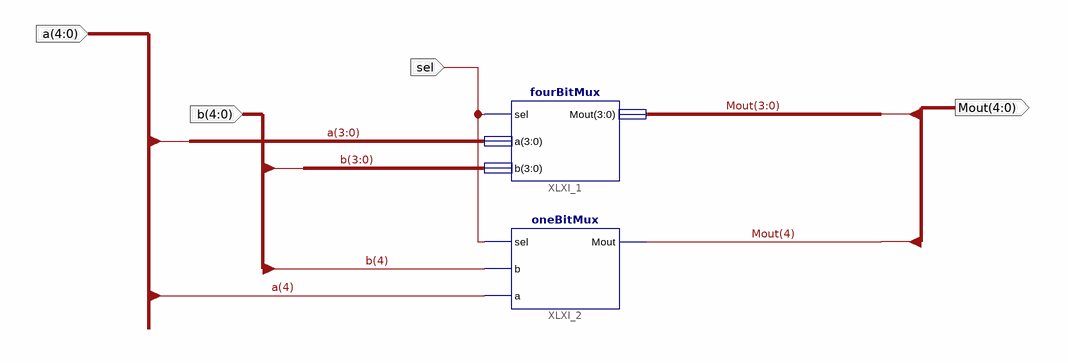
[diagram p0: schematic sheet 1]
// Xilinx ISE schematic fiveBitMux.sch (spartan3e) as structural Verilog: 2 symbols, 4 ports
module fiveBitMux (
  input  [4:0] a,
  input  [4:0] b,
  input  sel,
  output [4:0] Mout
);

  fourBitMux XLXI_1 (.sel(sel), .a(a[3:0]), .b(b[3:0]), .Mout(Mout[3:0]));
  oneBitMux XLXI_2 (.sel(sel), .b(b[4]), .a(a[4]), .Mout(Mout[4]));
endmodule
